# Altium schematic sheet Page 1.SchDoc
size 594 x 420 mm; Address1: Address1; Address2: Address2; Address3: Address3; Address4: Address4; DocumentNumber: АБВГ.123456.001 Э3; SheetNumber: 1; Scale: 1:1; DocumentType: Схема электрическая принципиальная; FirstReferrence: АБВГ.123456.001
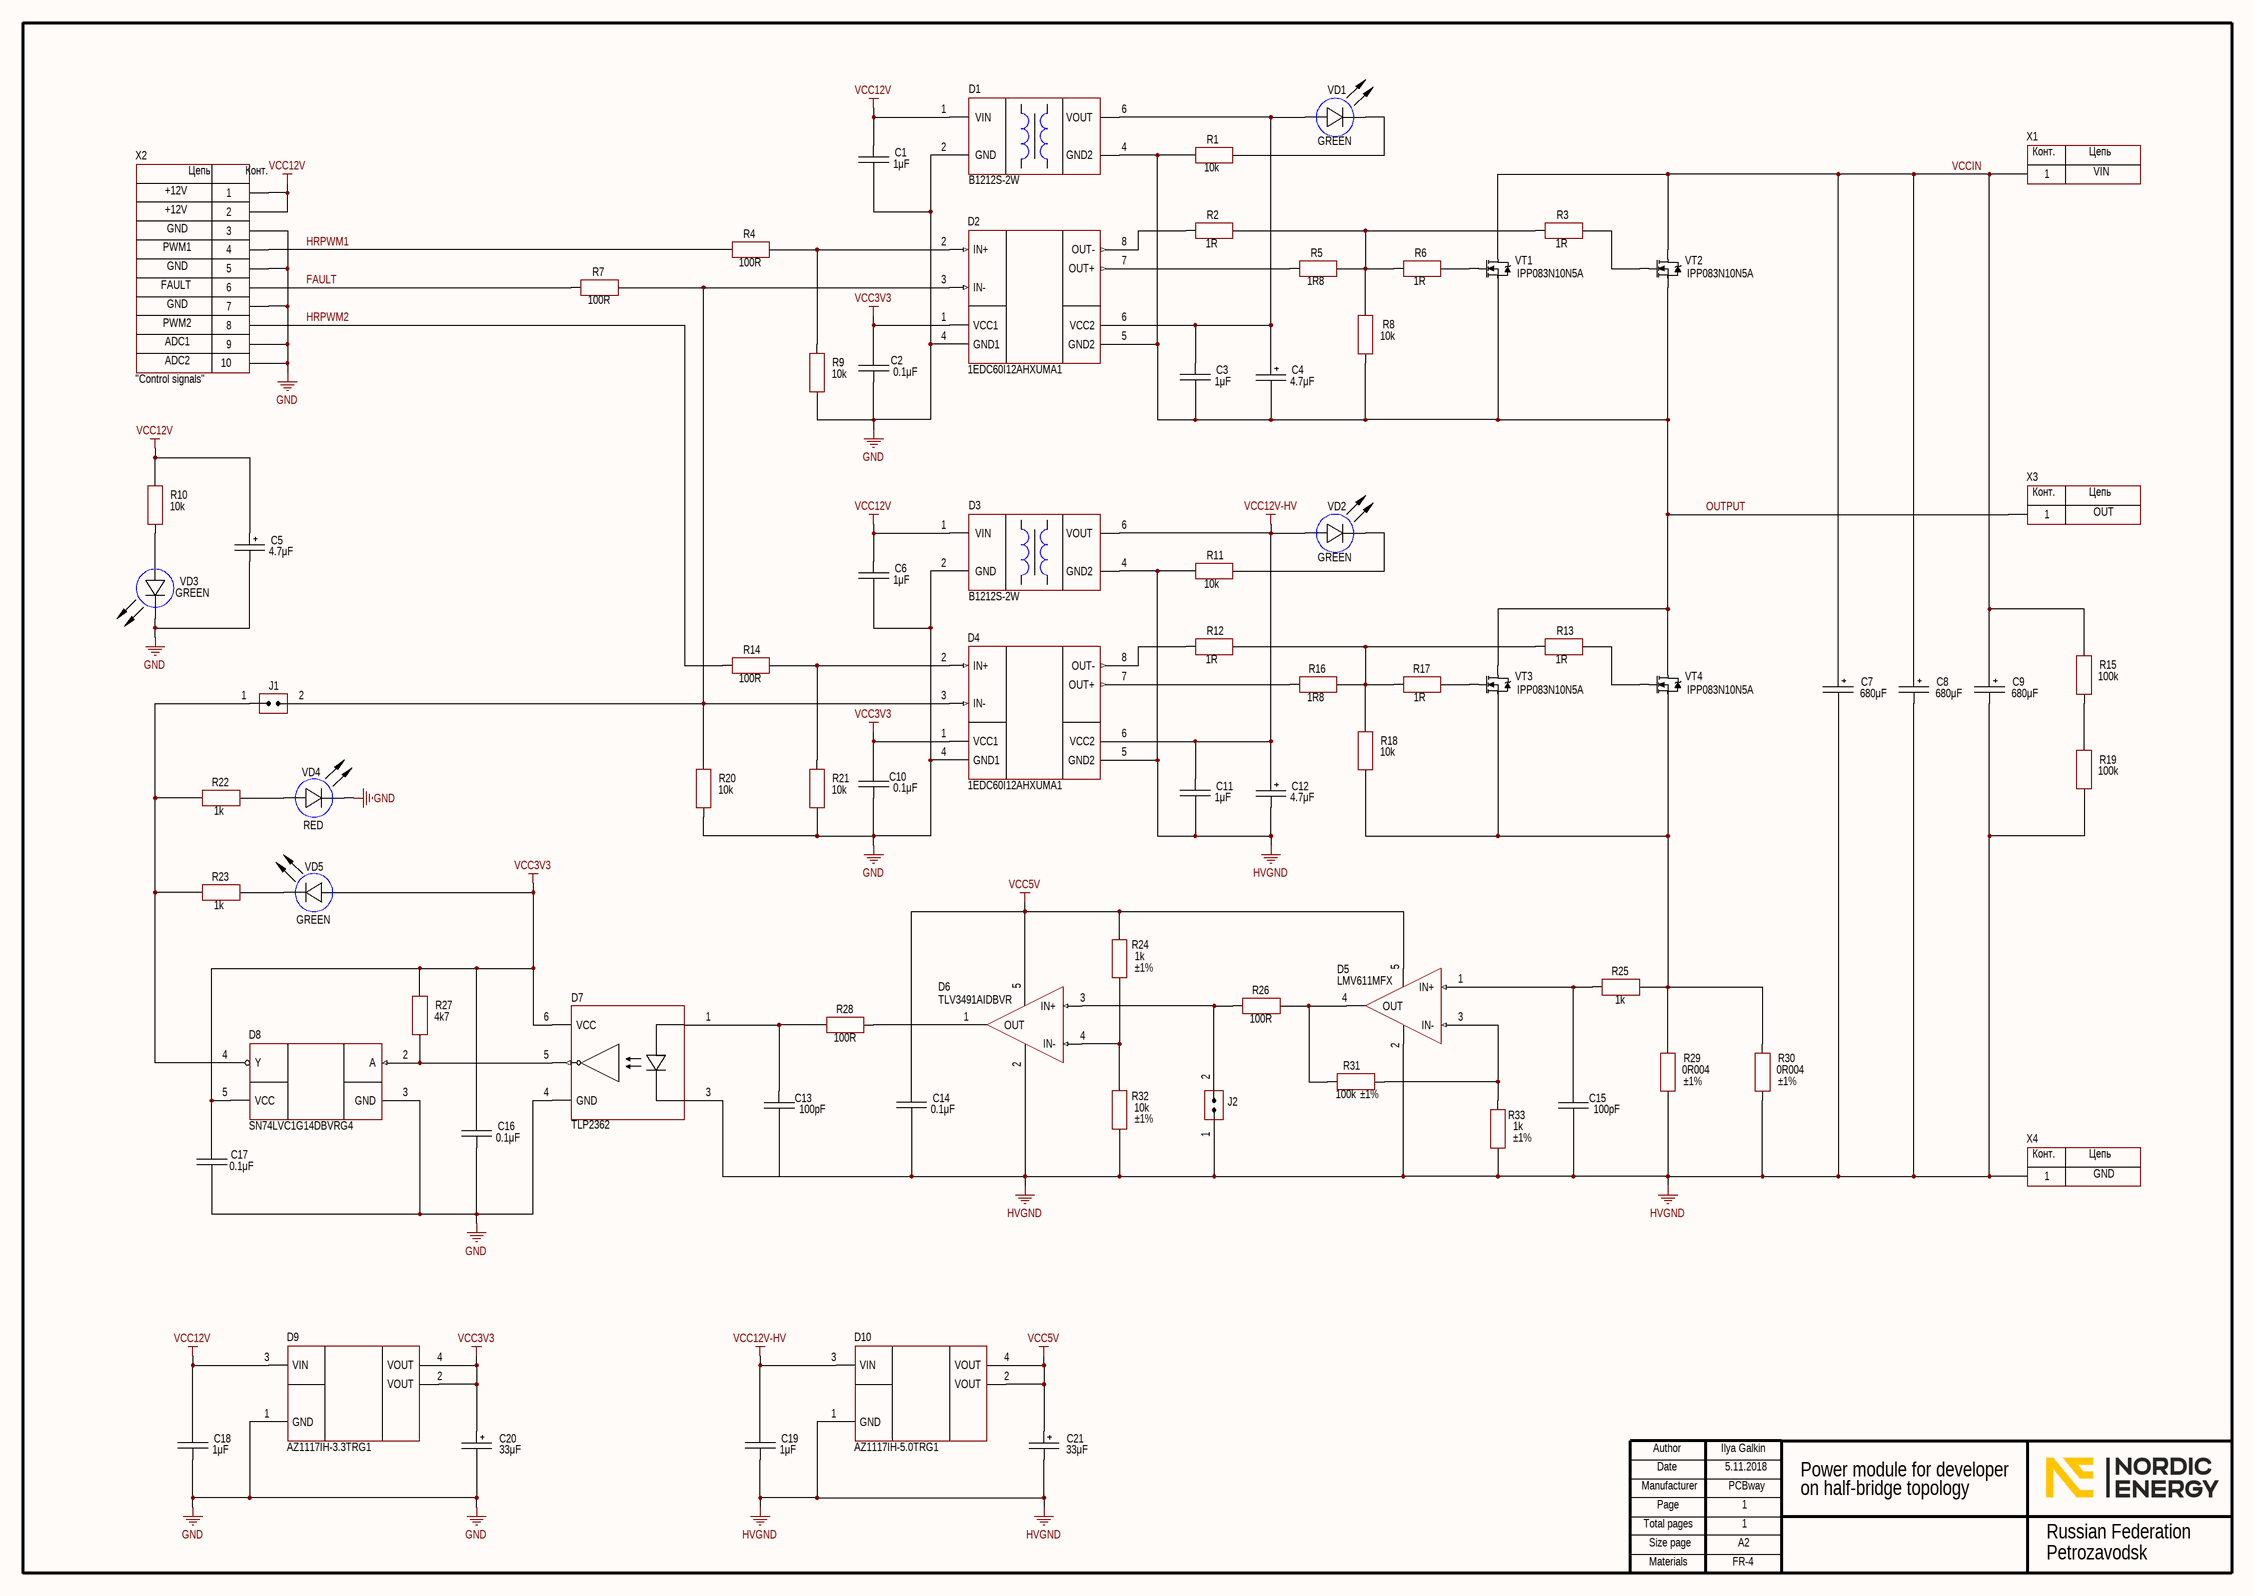
[diagram p0: Page 1.SchDoc]

## Parts
C1  1μF  [CH0805C]
C2  0.1μF  [CH0805C]
C3  1μF  [CH0805C]
C4  4.7μF  [TANTAL_A]
C5  4.7μF  [TANTAL_A]
C6  1μF  [CH0805C]
C7  680μF  [D22C10.5H25]
C8  680μF  [D22C10.5H25]
C9  680μF  [D22C10.5H25]
C10  0.1μF  [CH0805C]
C11  1μF  [CH0805C]
C12  4.7μF  [TANTAL_A]
C13  100pF  [CH0805C]
C14  0.1μF  [CH0805C]
C15  100pF  [CH0805C]
C16  0.1μF  [CH0805C]
C17  0.1μF  [CH0805C]
C18  1μF  [CH0805C]
C19  1μF  [CH0805C]
C20  33μF  [TANTAL_A]
C21  33μF  [TANTAL_A]
D1  B1212S-2W  [MOD: TMA-0505S]
D2  1EDC60I12AHXUMA1  [8-SO (300 mill)]
D3  B1212S-2W  [MOD: TMA-0505S]
D4  1EDC60I12AHXUMA1  [8-SO (300 mill)]
D5  LMV611MFX  [SOT23-5]
D6  TLV3491AIDBVR  [SOT23-5]
D7  TLP2362  [OPTO: TLP2362]
D8  SN74LVC1G14DBVRG4  [SOT23-5]
D9  AZ1117IH-3.3TRG1  [SOT223]
D10  AZ1117IH-5.0TRG1  [SOT223]
J1  Jumper-2  [CON: PLS-2]  (value not drawn)
J2  Jumper-2  [CON: PLS-2]  (value not drawn)
R1  10k  [CH0805R]
R2  1R  [CH0805R]
R3  1R  [CH0805R]
R4  100R  [CH0805R]
R5  1R8  [CH0805R]
R6  1R  [CH0805R]
R7  100R  [CH0805R]
R8  10k  [CH0805R]
R9  10k  [CH0805R]
R10  10k  [CH0805R]
R11  10k  [CH0805R]
R12  1R  [CH0805R]
R13  1R  [CH0805R]
R14  100R  [CH0805R]
R15  100k  [CH1206R]
R16  1R8  [CH0805R]
R17  1R  [CH0805R]
R18  10k  [CH0805R]
R19  100k  [CH1206R]
R20  10k  [CH0805R]
R21  10k  [CH0805R]
R22  1k  [CH0805R]
R23  1k  [CH0805R]
R24  1k  ComponentKind: ±1%  [CH0805R]
R25  1k  [CH0805R]
R26  100R  [CH0805R]
R27  4k7  [CH0805R]
R28  100R  [CH0805R]
R29  0R004  ComponentKind: ±1%  [CH2512R]
R30  0R004  ComponentKind: ±1%  [CH2512R]
R31  100k  ComponentKind: ±1%  [CH0805R]
R32  10k  ComponentKind: ±1%  [CH0805R]
R33  1k  ComponentKind: ±1%  [CH0805R]
VD1  GREEN  [CH0805LG]
VD2  GREEN  [CH0805LG]
VD3  GREEN  [CH0805LG]
VD4  RED  [CH0805LR]
VD5  GREEN  [CH0805LG]
VT1  IPP083N10N5A  [TO220_123]
VT2  IPP083N10N5A  [TO220_123]
VT3  IPP083N10N5A  [TO220_123]
VT4  IPP083N10N5A  [TO220_123]
X1  (no value)  [CON: 10x6 mm]
X2  "Control signals"  [CON: BH-10]
X3  (no value)  [CON: 10x6 mm]
X4  (no value)  [CON: 10x6 mm]

## Nets
GND: C1.1 C2.1 C5.2 C6.1 C10.1 C16.1 C17.1 C18.1 C20.2 D1.2(GND) D2.4(GND1) D3.2(GND) D4.4(GND1) D7.4(GND) D8.3(GND) D9.1(GND) R9.1 R20.1 R21.1 VD3.2(C) VD4.2(C) X2.3 X2.5 X2.7 X2.9 X2.10
HVGND: C7.2 C8.2 C9.2 C11.1 C12.2 C13.1 C14.1 C15.1 C19.1 C21.2 D3.4(GND2) D4.5(GND2) D5.2(V-) D6.2(V-) D7.3(C) D10.1(GND) J2.1(IN) R11.2 R19.1 R29.2 R30.2 R32.1 R33.1 X4.1
VCC3V3: C2.2 C10.2 C16.2 C17.2 C20.1 D2.1(VCC1) D4.1(VCC1) D7.6(VCC) D8.5(VCC) D9.2(VOUT) D9.4(VOUT) R27.2 VD5.1(A)
VCC5V: C14.2 C21.1 D5.5(V+) D6.5(V+) D10.2(VOUT) D10.4(VOUT) R24.2
VCC12V: C1.2 C5.1 C6.2 C18.2 D1.1(VIN) D3.1(VIN) D9.3(VIN) R10.2 X2.1 X2.2
VCC12V-HV: C11.2 C12.1 C19.2 D3.6(VOUT) D4.6(VCC2) D10.3(VIN) VD2.1(A)
FAULT: R7.1 X2.6
HRPWM1: R4.1 X2.4
HRPWM2: R14.1 X2.8
OUTPUT: C3.1 C4.2 D1.4(GND2) D2.5(GND2) R1.2 R8.1 VT1.3(S) VT2.3(S) VT3.2(D) VT4.2(D) X3.1
VCCIN: C7.1 C8.1 C9.1 R15.2 VT1.2(D) VT2.2(D) X1.1
NetC3_2: C3.2 C4.1 D1.6(VOUT) D2.6(VCC2) VD1.1(A)
NetC13_2: C13.2 D7.1(A) R28.1
NetC15_2: C15.2 D5.1(IN+) R25.1
NetD2_2: D2.2(IN+) R4.2 R9.2
NetD2_3: D2.3(IN-) D4.3(IN-) J1.2(IN) R7.2 R20.2
NetD2_7: D2.7(OUT+) R5.1
NetD2_8: D2.8(OUT-) R2.1
NetD4_2: D4.2(IN+) R14.2 R21.2
NetD4_7: D4.7(OUT+) R16.1
NetD4_8: D4.8(OUT-) R12.1
NetD5_3: D5.3(IN-) R31.1 R33.2
NetD5_4: D5.4(OUT) R26.2 R31.2
NetD6_1: D6.1(OUT) R28.2
NetD6_3: D6.3(IN+) J2.2(IN) R26.1
NetD6_4: D6.4(IN-) R24.1 R32.2
NetD7_5: D7.5(VOUT) D8.2(A) R27.1
NetD8_4: D8.4(Y) J1.1(IN) R22.2 R23.2
NetR1_1: R1.1 VD1.2(C)
NetR2_2: R2.2 R3.1 R5.2 R6.1 R8.2
NetR3_2: R3.2 VT2.1(G)
NetR6_2: R6.2 VT1.1(G)
NetR10_1: R10.1 VD3.1(A)
NetR11_1: R11.1 VD2.2(C)
NetR12_2: R12.2 R13.1 R16.2 R17.1 R18.2
NetR13_2: R13.2 VT4.1(G)
NetR15_1: R15.1 R19.2
NetR17_2: R17.2 VT3.1(G)
NetR18_1: R18.1 R25.2 R29.1 R30.1 VT3.3(S) VT4.3(S)
NetR22_1: R22.1 VD4.1(A)
NetR23_1: R23.1 VD5.2(C)

## Notes on the sheet
- +12V
- VIN
- PWM1
- GND
- FAULT
- PWM2
- ADC1
- ADC2
- OUT
- Ilya Galkin
- 5.11.2018
- PCBway
- 1
- Power module for developer
- on half-bridge topology
- FR-4
- Author
- Manufacturer
- Date
- Page
- Total pages
- Size page
- A2
- Petrozavodsk
- Russian Federation
- Materials
- (in symbol 1-Connector) Конт.; Цепь
- (in symbol 10-Connector) Цепь; Конт.

## Library data of the parts
C1 C3 C6 C11 C18 C19 = Capacitor: Manufacturer: Yageo; Model: CC0805KKX7R7BB105; HelpURL: https://www.digikey.com/product-detail/en/yageo/CC0805KKX7R7BB105/311-1365-1-ND/2103149; ComponentKind: X7R; Value: 1μF
C2 C10 C14 C16 C17 = Capacitor: Manufacturer: Yageo; Model: CC0805KRX7R7BB104; HelpURL: https://www.digikey.com/product-detail/en/yageo/CC0805KRX7R7BB104/311-1142-1-ND/303052; ComponentKind: X7R; Value: 0.1μF
C4 C5 C12 = TantalCap: Manufacturer: KEMET; Model: T494A475M025AT; HelpURL: https://www.digikey.com/product-detail/en/kemet/T494A475M025AT/399-4636-1-ND/992068; ComponentKind: 25V; Value: 4.7μF
C7-C9 = AlumCap: Manufacturer: Yageo; Model: LG100M0680BPF-2225; HelpURL: https://www.electronshik.ru/item/YAG/LG100M0680BPF-2225; ComponentKind: 100V; Value: 680μF
C13 C15 = Capacitor: Manufacturer: Yageo; Model: CC0805KRNPO9BN101; HelpURL: https://www.digikey.com/product-detail/en/yageo/CC0805KRNPO9BN101/311-4295-1-ND/8025384; ComponentKind: NP0; Value: 100pF
C20 C21 = TantalCap: Manufacturer: AVX; Model: TPSA336K010R0700; HelpURL: https://www.digikey.com/product-detail/en/avx-corporation/TPSA336K010R0700/478-9042-1-ND/4561908; ComponentKind: 10V; Value: 33μF
D1 D3 = TMA-0505S: Isolator DC; Manufacturer: Mornsun; Model: B1212S-2W; ComponentKind: 2W; HelpURL: https://ru.aliexpress.com/item/isolated-dc-dc-converters-12v-to-12v-power-module-dc-dc-switching-power-supply-B1212S-2W/1931653832.html?spm=a2g0s.13010208.99999999.345.3aab3c00yobnOf
D2 D4 = 1EDC60I12AHXUMA1: Driver; Manufacturer: Infineon Technologies; Model: 1EDC60I12AHXUMA1; HelpURL: https://ru.mouser.com/ProductDetail/Infineon-Technologies/1EDC60I12AHXUMA1?qs=%2fha2pyFaduiIlS5yEUGYV6QsF6GkGmNxTXgHdAe519b2q6MWBHFGMw%3d%3d; ComponentKind: 10A
D5 = LMV611MFX: Amplifer; Manufacturer: Texas Instruments; Model: LMV611MFX/NOPB; ComponentKind: SOT-23-5; HelpURL: https://www.digikey.com/product-detail/en/texas-instruments/LMV611MFX-NOPB/296-47209-1-ND/7688219
D6 = TLV3491AIDBVR: Comparator; Manufacturer: Texas Instruments; Model: TLV3491AIDBVR; ComponentKind: SOT-23-5; HelpURL: https://ru.mouser.com/ProductDetail/Texas-Instruments/TLV3491AIDBVR?qs=sGAEpiMZZMuayl%2fEk2kXcUD3k0KZjJUukKOiHoYYFBw%3d
D7 = TLP2362: Optoisolator; Manufacturer: Toshiba; Model: TLP2362; ComponentKind: 6-SOIC; HelpURL: https://www.digikey.com/product-detail/en/toshiba-semiconductor-and-storage/TLP2362-TPRE/TLP2362-TPRECT-ND/5189801
D8 = SN74LVC1G14DBVRG4: Inverter logic; Manufacturer: Texas Instruments; Model: SN74LVC1G14DBVRG4; HelpURL: https://www.digikey.com/product-detail/en/texas-instruments/SN74LVC1G14DBVRG4/296-35945-1-ND/4135035; ComponentKind: SOT-23-5
D9 D10 = LDL1117S33R: LDO; Manufacturer: Diodes Incorporated; ComponentKind: SOT-223
  D9: Model: AZ1117IH-3.3TRG1; HelpURL: https://www.digikey.com/product-detail/en/diodes-incorporated/AZ1117IH-3.3TRG1/AZ1117IH-3.3TRG1DIDKR-ND/5699692
  D10: Model: AZ1117IH-5.0TRG1; HelpURL: https://www.digikey.com/product-detail/en/diodes-incorporated/AZ1117IH-5.0TRG1/AZ1117IH-5.0TRG1DICT-ND/5699683
J1 J2 = Jumper-2: Jumper; Manufacturer: China; Model: PLS-2
R1 R8-R11 R18 R20 R21 = Resistor: Manufacturer: Yageo; Model: RC0805JR-0710KL; HelpURL: https://www.digikey.com/product-detail/en/yageo/RC0805JR-0710KL/311-10KARCT-ND/731188; ComponentKind: ±5%; Value: 10k
R2 R3 R6 R12 R13 R17 = Resistor: Manufacturer: Yageo; Model: RC0805JR-071RL; HelpURL: https://www.digikey.com/product-detail/en/yageo/RC0805JR-071RL/311-1.0ARTR-ND/728217; ComponentKind: ±5%; Value: 1R
R4 R7 R14 R26 R28 = Resistor: Manufacturer: Yageo; Model: RC0805JR-07100RL; HelpURL: https://www.digikey.com/product-detail/en/yageo/RC0805JR-07100RL/311-100ARCT-ND/731185; ComponentKind: ±5%; Value: 100R
R5 R16 = Resistor: Manufacturer: Yageo; Model: RC0805JR-071R8L; HelpURL: https://www.digikey.com/products/en?keywords=RC0805JR-071R8; ComponentKind: ±5%; Value: 1R8
R15 R19 = Resistor: Manufacturer: Yageo; Model: RC1206JR-07100KL; HelpURL: https://www.digikey.com/product-detail/en/yageo/RC1206JR-07100KL/311-100KERCT-ND/732154; ComponentKind: ±5%; Value: 100k
R22 R23 R25 = Resistor: Manufacturer: Yageo; Model: RC0805JR-071KL; HelpURL: https://www.digikey.com/product-detail/en/yageo/RC0805JR-071KL/311-1.0KARCT-ND/731165; ComponentKind: ±5%; Value: 1k
R24 R33 = Resistor: Manufacturer: Yageo; Model: RC0805FR-071KL; HelpURL: https://www.digikey.com/product-detail/en/yageo/RC0805FR-071KL/311-1.00KCRCT-ND/730391; Value: 1k
R27 = Resistor: Manufacturer: Yageo; Model: RC0805JR-074K7L; HelpURL: https://www.digikey.com/product-detail/en/yageo/RC0805JR-074K7L/311-4.7KARCT-ND/731274; ComponentKind: ±5%; Value: 4k7
R29 R30 = Resistor: Manufacturer: Yageo; Model: PA2512FKF7W0R004E; HelpURL: https://www.digikey.com/product-detail/en/yageo/PA2512FKF7W0R004E/YAG2144CT-ND/5139592; Value: 0R004
R31 = Resistor: Manufacturer: Yageo; Model: RC0805FR-07100KL; HelpURL: https://www.digikey.com/product-detail/en/yageo/RC0805FR-07100KL/311-100KCRCT-ND/730491; Value: 100k
R32 = Resistor: Manufacturer: Yageo; Model: RC0805FR-0710KL; HelpURL: https://www.digikey.com/product-detail/en/yageo/RC0805FR-0710KL/311-10.0KCRCT-ND/730482; Value: 10k
VD1-VD3 VD5 = LED: Manufacturer: Wurth Electronics Inc.; Model: 150080VS75000; HelpURL: https://ru.mouser.com/ProductDetail/Wurth-Electronics/150080VS75000?qs=%2fha2pyFadui8PTKZ9%2fyBvoZuOSVtqh1MVddimbE8gNgJLJOQsbJetQ%3d%3d; ComponentKind: 0805; Value: GREEN
VD4 = LED: Manufacturer: Wurth Electronics Inc.; Model: 150080RS75000; HelpURL: https://ru.mouser.com/ProductDetail/Wurth-Electronics/150080RS75000?qs=%2fha2pyFaduhhn%252bgbNutj8dx7klCOsxjQy5hBavp5HwRRQxIO9uv%2fYQ%3d%3d; ComponentKind: 0805; Value: RED
VT1-VT4 = N-chanel: Mosfet; Manufacturer: Infineon; Model: IPP083N10N5AKSA1; ComponentKind: 100V; HelpURL: https://www.digikey.com/product-detail/en/infineon-technologies/IPP083N10N5AKSA1/IPP083N10N5AKSA1-ND/5960342
X1 X3 X4 = 1-Connector: Model: *; Manufacturer: *; HelpURL: *; ComponentKind: *
X2 = 10-Connector: Manufacturer: Connfly; Model: IDC-10MS; HelpURL: https://www.chipdip.ru/product/bh-08-ds1013-08s-idc-08ms; ComponentKind: 10 pin